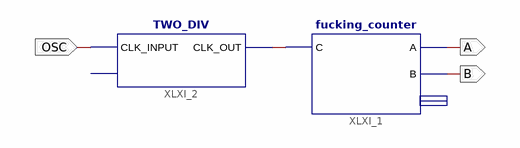
[diagram p0: schematic sheet 1]
// Xilinx ISE schematic test.sch (spartan6) as structural Verilog: 2 symbols, 3 ports
module test (
  input  OSC,
  output A,
  output B
);

  wire XLXN_1;

  fucking_counter XLXI_1 (.C(XLXN_1), .A(A), .B(B));  // open: Q
  TWO_DIV XLXI_2 (.CLK_INPUT(OSC), .CLK_OUT(XLXN_1));  // open: CLR_DATA
endmodule
